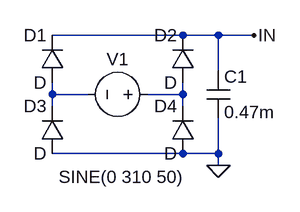
[diagram p0: schematic full_wave.asc]
full_wave.asc, the LTspice schematic file:
Version 4
SHEET 1 880 680
WIRE 128 -144 -48 -144
WIRE 176 -144 128 -144
WIRE 224 -144 176 -144
WIRE 176 -96 176 -144
WIRE -48 -64 -48 -80
WIRE 0 -64 -48 -64
WIRE 128 -64 128 -80
WIRE 128 -64 80 -64
WIRE -48 -48 -48 -64
WIRE 128 -48 128 -64
WIRE 128 16 -48 16
WIRE 176 16 176 -32
WIRE 176 16 128 16
WIRE 176 32 176 16
FLAG 224 -144 IN
FLAG 176 32 0
SYMBOL diode -32 -80 R180
WINDOW 0 24 64 Left 2
WINDOW 3 24 0 Left 2
SYMATTR InstName D1
SYMBOL diode 144 -80 R180
WINDOW 0 24 64 Left 2
WINDOW 3 24 0 Left 2
SYMATTR InstName D2
SYMBOL diode -32 16 R180
WINDOW 0 24 64 Left 2
WINDOW 3 24 0 Left 2
SYMATTR InstName D3
SYMBOL diode 144 16 R180
WINDOW 0 24 64 Left 2
WINDOW 3 24 0 Left 2
SYMATTR InstName D4
SYMBOL cap 160 -96 R0
SYMATTR InstName C1
SYMATTR Value 0.47m
SYMATTR SpiceLine V=450
SYMBOL voltage 96 -64 R90
WINDOW 0 -32 56 VBottom 2
WINDOW 3 96 52 VTop 2
WINDOW 123 0 0 Left 0
WINDOW 39 0 0 Left 0
SYMATTR InstName V1
SYMATTR Value SINE(0 310 50)

The netlist it stands for:
* full_wave.asc
D1 N001 IN D
D2 N002 IN D
D3 0 N001 D
D4 0 N002 D
C1 IN 0 0.47m V=450
V1 N002 N001 SINE(0 310 50)
.model D D
.lib standard.dio
.backanno
.end